# EAGLE schematic BeagleBone_Blue (EAGLE 7.3.0), part 2 of 2
## Sheet 10 of 10
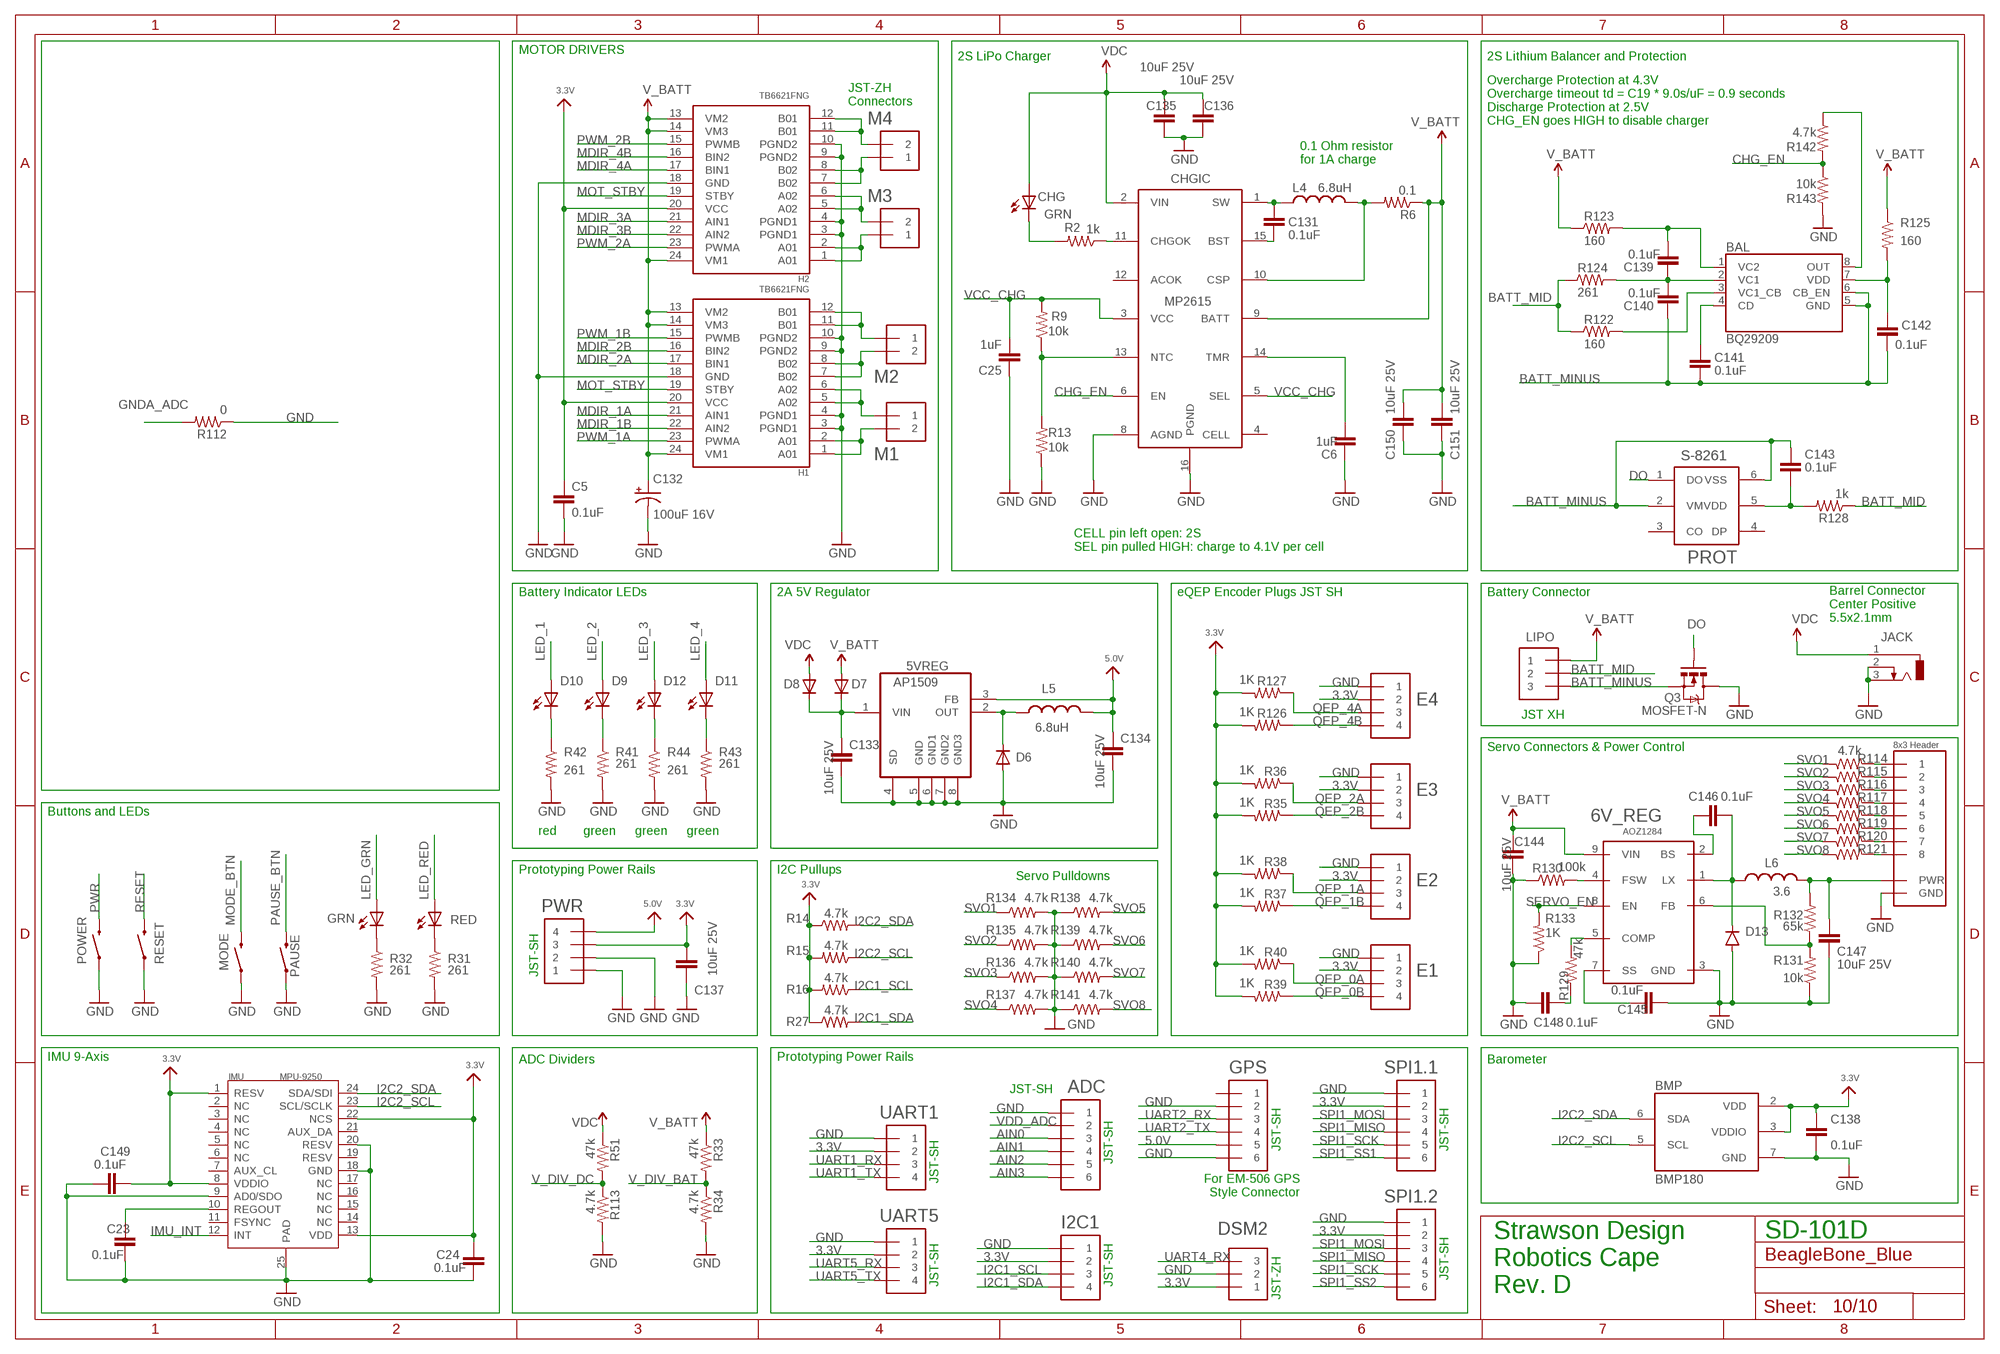
[diagram p15: schematic, sheet 10]

### Parts
5VREG  AP1509SOIC-8-TIGHT  [SO08-TIGHT]
6V_REG  AOZ1284  [SO08-EXPOSED]
ADC  JST_SH_6  [JST_SH_6]
BAL  BQ29209  [8-SON_3X3MM]
BMP  BMP180  [BMP180]
C5  0.1uF  CAP0402-CAP  [0402-CAP]
C6  1uF  CAP0402-CAP  [0402-CAP]
C23  0.1uF  CAP0402-CAP  [0402-CAP]
C24  0.1uF  CAP0402-CAP  [0402-CAP]
C25  1uF  CAP0402-CAP  [0402-CAP]
C131  0.1uF  CAP0402-CAP  [0402-CAP]
C132  100uF 16V  CPOL-USD  [PANASONIC_D]
C133  10uF 25V  CAP0805  [0805]
C134  10uF 25V  CAP0805  [0805]
C135  10uF 25V  CAP0805  [0805]
C136  10uF 25V  CAP0805  [0805]
C137  10uF 25V  CAP0805  [0805]
C138  0.1uF  CAP0402-CAP  [0402-CAP]
C139  0.1uF  CAP0402-CAP  [0402-CAP]
C140  0.1uF  CAP0402-CAP  [0402-CAP]
C141  0.1uF  CAP0402-CAP  [0402-CAP]
C142  0.1uF  CAP0402-CAP  [0402-CAP]
C143  0.1uF  CAP0402-CAP  [0402-CAP]
C144  10uF 25V  CAP0805  [0805]
C145  0.1uF  CAP0402-CAP  [0402-CAP]
C146  0.1uF  CAP0402-CAP  [0402-CAP]
C147  10uF 25V  CAP0805  [0805]
C148  0.1uF  CAP0402-CAP  [0402-CAP]
C149  0.1uF  CAP0402-CAP  [0402-CAP]
C150  10uF 25V  CAP0805  [0805]
C151  10uF 25V  CAP0805  [0805]
CHG  GRN  LED0603  [LED-0603]
CHGIC  MP2615  [MP2615]
D6  DIODESOD-123  [SOD-123]
D7  DIODESOD-123  [SOD-123]
D8  DIODESOD-123  [SOD-123]
D9  GREEN  LED0603  [LED-0603]
D10  RED  LED0603  [LED-0603]
D11  GREEN  LED0603  [LED-0603]
D12  GREEN  LED0603  [LED-0603]
D13  DIODEDO214AA  [DO-214AA]
DSM2  JST_ZH_3  [JST_ZH_3]
E1  JST_SH_4  [JST_SH_4_SMD]
E2  JST_SH_4  [JST_SH_4_SMD]
E3  JST_SH_4  [JST_SH_4_SMD]
E4  JST_SH_4  [JST_SH_4_SMD]
GPS  JST_SH_6  [JST_SH_6]
GRN  GRN  LED0603  [LED-0603]
H1  TB6621FNG  [SSOP24]
H2  TB6621FNG  [SSOP24]
I2C1  JST_SH_4  [JST_SH_4_SMD]
IMU  MPU-9250  [QFN24G-0.4-3X3MM]
JACK  5.5x2.1mm  DCJ0303  [DCJ0303]
L4  6.8uH  INDUCTORBOURNS_SRN6045  [SRN6045]
L5  6.8uH  INDUCTORBOURNS_SRN6045  [SRN6045]
L6  3.6  INDUCTOR  [8X8MM_INDUCTOR]
LIPO  JST_XH_3-PIN  [JST_XH_3-PIN]
M1  JST_ZH_2  [JST_ZH_2]
M2  JST_ZH_2  [JST_ZH_2]
M3  JST_ZH_2  [JST_ZH_2]
M4  JST_ZH_2  [JST_ZH_2]
MODE  SWITCH-MOMENTARY-2-SMD-1101NE  [TACTILE-SWITCH-1101NE]
PAUSE  SWITCH-MOMENTARY-2-SMD-1101NE  [TACTILE-SWITCH-1101NE]
POWER  SWITCH-MOMENTARY-2-SMD-1101NE  [TACTILE-SWITCH-1101NE]
PROT  S-8261  [SOT-236]
PWR  JST_SH_4  [JST_SH_4_SMD]
Q3  MOSFET-N  MOSFET-NCHANNEL  [SO08-TIGHT]
R2  1k  RESISTOR0402-RES  [0402-RES]
R6  0.1  RESISTOR0603  [0603-RES]
R9  10k  RESISTOR0402-RES  [0402-RES]
R13  10k  RESISTOR0402-RES  [0402-RES]
R14  4.7k  RESISTOR0402-RES  [0402-RES]
R15  4.7k  RESISTOR0402-RES  [0402-RES]
R16  4.7k  RESISTOR0402-RES  [0402-RES]
R27  4.7k  RESISTOR0402-RES  [0402-RES]
R31  261  RESISTOR0402-RES  [0402-RES]
R32  261  RESISTOR0402-RES  [0402-RES]
R33  47k  RESISTOR0402-RES  [0402-RES]
R34  4.7k  RESISTOR0402-RES  [0402-RES]
R35  1K  RESISTOR0402-RES  [0402-RES]
R36  1K  RESISTOR0402-RES  [0402-RES]
R37  1K  RESISTOR0402-RES  [0402-RES]
R38  1K  RESISTOR0402-RES  [0402-RES]
R39  1K  RESISTOR0402-RES  [0402-RES]
R40  1K  RESISTOR0402-RES  [0402-RES]
R41  261  RESISTOR0402-RES  [0402-RES]
R42  261  RESISTOR0402-RES  [0402-RES]
R43  261  RESISTOR0402-RES  [0402-RES]
R44  261  RESISTOR0402-RES  [0402-RES]
R51  47k  RESISTOR0402-RES  [0402-RES]
R112  0  RESISTOR0603  [0603-RES]
R113  4.7k  RESISTOR0402-RES  [0402-RES]
R114  4.7k  RESISTOR0402-RES  [0402-RES]
R115  4.7k  RESISTOR0402-RES  [0402-RES]
R116  4.7k  RESISTOR0402-RES  [0402-RES]
R117  4.7k  RESISTOR0402-RES  [0402-RES]
R118  4.7k  RESISTOR0402-RES  [0402-RES]
R119  4.7k  RESISTOR0402-RES  [0402-RES]
R120  4.7k  RESISTOR0402-RES  [0402-RES]
R121  4.7k  RESISTOR0402-RES  [0402-RES]
R122  160  RESISTOR0402-RES  [0402-RES]
R123  160  RESISTOR0402-RES  [0402-RES]
R124  261  RESISTOR0402-RES  [0402-RES]
R125  160  RESISTOR0402-RES  [0402-RES]
R126  1K  RESISTOR0402-RES  [0402-RES]
R127  1K  RESISTOR0402-RES  [0402-RES]
R128  1k  RESISTOR0402-RES  [0402-RES]
R129  47k  RESISTOR0402-RES  [0402-RES]
R130  100k  RESISTOR0402-RES  [0402-RES]
R131  10k  RESISTOR0402-RES  [0402-RES]
R132  65k  RESISTOR0402-RES  [0402-RES]
R133  1K  RESISTOR0402-RES  [0402-RES]
R134  4.7k  RESISTOR0402-RES  [0402-RES]
R135  4.7k  RESISTOR0402-RES  [0402-RES]
R136  4.7k  RESISTOR0402-RES  [0402-RES]
R137  4.7k  RESISTOR0402-RES  [0402-RES]
R138  4.7k  RESISTOR0402-RES  [0402-RES]
R139  4.7k  RESISTOR0402-RES  [0402-RES]
R140  4.7k  RESISTOR0402-RES  [0402-RES]
R141  4.7k  RESISTOR0402-RES  [0402-RES]
R142  4.7k  RESISTOR0402-RES  [0402-RES]
R143  10k  RESISTOR0402-RES  [0402-RES]
RED  RED  LED0603  [LED-0603]
RESET  SWITCH-MOMENTARY-2-SMD-1101NE  [TACTILE-SWITCH-1101NE]
SPI1.1  JST_SH_6  [JST_SH_6]
SPI1.2  JST_SH_6  [JST_SH_6]
U$7  SERVO_HEADERS_8X  [3X8_0.1"_HEADER]
UART1  JST_SH_4  [JST_SH_4_SMD]
UART5  JST_SH_4  [JST_SH_4_SMD]

### Nets
3.3V: BMP.2(VDD) BMP.3(VDDIO) C5.2 C24.1 C137.1 C138.1 C149.2 DSM2.P$1 E1.2 E2.2 E3.2 E4.2 H1.20(VCC) H2.20(VCC) I2C1.2 IMU.1(RESV) IMU.8(VDDIO) IMU.13(VDD) IMU.22(NCS) PWR.3 R14.1 R15.2 R16.2 R27.1 R35.2 R36.2 R37.2 R38.2 R39.2 R40.2 R126.2 R127.2 SPI1.1.2 SPI1.2.2 UART1.2 UART5.2
5.0V: 5VREG.3(FB) C134.1 GPS.5 L5.2 PWR.4
AIN0: ADC.3 ; also sheet 4
AIN1: ADC.4 ; also sheet 4
AIN2: ADC.5 ; also sheet 4
AIN3: ADC.6 ; also sheet 4
BATT_MID: LIPO.P$2 R122.1 R124.1 R128.1
BATT_MINUS: BAL.5(GND) BAL.6(CB_EN) C140.1 C141.2 C142.2 C143.1 LIPO.P$3 PROT.2(VM) PROT.6(VSS) Q3.1(S) Q3.2(S) Q3.3(S)
CHG_EN: CHGIC.6(EN) R142.2 R143.1
CO: BAL.8(OUT) R142.1
DO: PROT.1(DO) Q3.4(G)
GND: 5VREG.4(SD) 5VREG.5(GND) 5VREG.6(GND1) 5VREG.7(GND2) 5VREG.8(GND3) 6V_REG.3(GND) ADC.1 BMP.7(GND) C5.1 C6.1 C23.2 C24.2 C25.1 C132.- C133.2 C134.2 C135.2 C136.2 C137.2 C138.2 C144.1 C145.1 C147.1 C148.1 C149.1 C150.2 C151.2 CHGIC.8(AGND) CHGIC.16(PGND) D6.A D13.A DSM2.P$2 E1.1 E2.1 E3.1 E4.1 GPS.2 GPS.6 H1.3(PGND1) H1.4(PGND1) H1.9(PGND2) H1.10(PGND2) H1.18(GND) H2.3(PGND1) H2.4(PGND1) H2.9(PGND2) H2.10(PGND2) H2.18(GND) I2C1.1 IMU.9(AD0/SDO) IMU.18(GND) IMU.20(RESV) IMU.25(PAD) JACK.2 JACK.3 MODE.P$1 PAUSE.P$1 POWER.P$1 PWR.1 PWR.2 Q3.5(D) Q3.6(D) Q3.7(D) Q3.8(D) R13.1 R31.2 R32.2 R34.2 R41.2 R42.2 R43.2 R44.2 R112.1 R113.2 R130.1 R131.1 R133.1 R134.2 R135.2 R136.2 R137.2 R138.1 R139.1 R140.1 R141.1 R143.2 RESET.P$1 SPI1.1.1 SPI1.2.1 U$7.P$13(GND) U$7.P$14(GND) U$7.P$15(GND) U$7.P$16(GND) U$7.P$17(GND) U$7.P$18(GND) U$7.P$23(GND) U$7.P$24(GND) UART1.1 UART5.1 ; also sheet 2,3,4,5,6,7,8,9
GNDA_ADC: R112.2
I2C1_SCL: I2C1.3 R16.1 ; also sheet 4
I2C1_SDA: I2C1.4 R27.2 ; also sheet 4
I2C2_SCL: BMP.5(SCL) IMU.23(SCL/SCLK) R15.1 ; also sheet 4
I2C2_SDA: BMP.6(SDA) IMU.24(SDA/SDI) R14.2 ; also sheet 4
IMU_INT: IMU.12(INT) ; also sheet 3,4
L3: D12.C R44.1
L4: D11.C R43.1
LED_1: D10.A ; also sheet 3
LED_2: D9.A ; also sheet 3
LED_3: D12.A ; also sheet 3
LED_4: D11.A ; also sheet 3
LED_GRN: GRN.A ; also sheet 3
LED_RED: RED.A ; also sheet 3
MDIR_1A: H1.21(AIN1) ; also sheet 3
MDIR_1B: H1.22(AIN2) ; also sheet 3
MDIR_2A: H1.17(BIN1) ; also sheet 3
MDIR_2B: H1.16(BIN2) ; also sheet 4,6
MDIR_3A: H2.21(AIN1) ; also sheet 4,6
MDIR_3B: H2.22(AIN2) ; also sheet 4,6
MDIR_4A: H2.17(BIN1) ; also sheet 4,6
MDIR_4B: H2.16(BIN2) ; also sheet 4,6
MODE_BTN: MODE.P$2 ; also sheet 3
MOT1A: H1.1(A01) H1.2(A01) M1.P$2
MOT1B: H1.5(A02) H1.6(A02) M1.P$1
MOT2A: H1.11(B01) H1.12(B01) M2.P$1
MOT2B: H1.7(B02) H1.8(B02) M2.P$2
MOT3A: H2.1(A01) H2.2(A01) M3.P$1
MOT3B: H2.5(A02) H2.6(A02) M3.P$2
MOT4A: H2.11(B01) H2.12(B01) M4.P$2
MOT4B: H2.7(B02) H2.8(B02) M4.P$1
MOT_STBY: H1.19(STBY) H2.19(STBY) ; also sheet 3
N$4: CHG.C R2.2
N$5: GRN.C R32.1
N$6: R31.1 RED.C
N$7: R114.2 U$7.P$1
N$10: BAL.2(VC1) C139.1 C140.2 R124.2
N$11: BAL.1(VC2) C139.2 R123.2
N$12: C143.2 PROT.5(VDD) R128.2
N$13: 6V_REG.7(SS) C145.2
N$14: C23.1 IMU.10(REGOUT)
N$15: C131.1 CHGIC.15(BST)
N$16: 5VREG.2(OUT) D6.C L5.1
N$18: CHGIC.11(CHGOK) R2.1
N$20: CHGIC.13(NTC) R9.1 R13.2
N$24: BAL.4(CD) C141.1
N$25: R115.2 U$7.P$2
N$29: BAL.7(VDD) C142.1 R125.2
N$30: R116.2 U$7.P$3
N$38: R117.2 U$7.P$4
N$48: D9.C R41.1
N$49: D10.C R42.1
N$50: BAL.3(VC1_CB) R122.2
N$51: R118.2 U$7.P$5
N$52: R119.2 U$7.P$6
N$53: 6V_REG.2(BS) C146.1
N$54: R120.2 U$7.P$19
N$55: C131.2 CHGIC.1(SW) L4.1
N$56: R121.2 U$7.P$20
N$60: 6V_REG.1(LX) C146.2 D13.C L6.1
N$61: 6V_REG.4(FSW) R130.2
N$62: C147.2 L6.2 R132.2 U$7.P$7(PWR) U$7.P$8(PWR) U$7.P$9(PWR) U$7.P$10(PWR) U$7.P$11(PWR) U$7.P$12(PWR) U$7.P$21(PWR) U$7.P$22(PWR)
N$63: 6V_REG.5(COMP) R129.2
N$65: 6V_REG.6(FB) R131.2 R132.1
N$66: C148.2 R129.1
N$67: CHGIC.10(CSP) L4.2 R6.2
N$69: C6.2 CHGIC.14(TMR)
N$79: 5VREG.1(VIN) C133.1 D7.C D8.C
PAUSE_BTN: PAUSE.P$2 ; also sheet 3
PWM_1A: H1.23(PWMA) ; also sheet 3
PWM_1B: H1.15(PWMB) ; also sheet 3
PWM_2A: H2.23(PWMA) ; also sheet 3
PWM_2B: H2.15(PWMB) ; also sheet 3
PWR: POWER.P$2
QEP_0A: E1.3 R40.1 ; also sheet 4
QEP_0B: E1.4 R39.1 ; also sheet 4
QEP_1A: E2.3 R38.1 ; also sheet 4,6
QEP_1B: E2.4 R37.1 ; also sheet 4,6
QEP_2A: E3.3 R36.1 ; also sheet 3
QEP_2B: E3.4 R35.1 ; also sheet 3
QEP_4A: E4.3 R127.1 ; also sheet 3
QEP_4B: E4.4 R126.1 ; also sheet 3
RESET: RESET.P$2
SERVO_EN: 6V_REG.8(EN) R133.2 ; also sheet 4,6
SPI1_MISO: SPI1.1.4 SPI1.2.4 ; also sheet 4
SPI1_MOSI: SPI1.1.3 SPI1.2.3 ; also sheet 4
SPI1_SCK: SPI1.1.5 SPI1.2.5
SPI1_SS1: SPI1.1.6
SPI1_SS2: SPI1.2.6 ; also sheet 4
SVO1: R114.1 R134.1 ; also sheet 4
SVO2: R115.1 R135.1 ; also sheet 4
SVO3: R116.1 R136.1 ; also sheet 4
SVO4: R117.1 R137.1 ; also sheet 4
SVO5: R118.1 R138.2 ; also sheet 4,6
SVO6: R119.1 R139.2 ; also sheet 4,6
SVO7: R120.1 R140.2 ; also sheet 4,6
SVO8: R121.1 R141.2 ; also sheet 4,6
UART1_RX: UART1.3 ; also sheet 4
UART1_TX: UART1.4 ; also sheet 4
UART2_RX: GPS.3 ; also sheet 4
UART2_TX: GPS.4 ; also sheet 4
UART4_RX: DSM2.P$3 ; also sheet 3
UART5_RX: UART5.3 ; also sheet 4,6
UART5_TX: UART5.4 ; also sheet 4,6
V_BATT: 6V_REG.9(VIN) C132.+ C144.2 C150.1 C151.1 CHGIC.9(BATT) D7.A H1.13(VM2) H1.14(VM3) H1.24(VM1) H2.13(VM2) H2.14(VM3) H2.24(VM1) LIPO.P$1 R6.1 R33.1 R123.1 R125.1
V_DIV_BAT: R33.2 R34.1
V_DIV_DC: R51.2 R113.1
VCC: C135.1 C136.1 CHG.A CHGIC.2(VIN) D8.A JACK.1 R51.1 ; supply symbol labelled VDC ; also sheet 2,3,4,5,6,7,8,9
VCC_CHG: C25.2 CHGIC.3(VCC) CHGIC.5(SEL) R9.2
VDD_ADC: ADC.2
Unconnected: CHGIC.4(CELL) CHGIC.12(ACOK) GPS.1 IMU.2(NC) IMU.3(NC) IMU.4(NC) IMU.5(NC) IMU.6(NC) IMU.7(AUX_CL) IMU.11(FSYNC) IMU.14(NC) IMU.15(NC) IMU.16(NC) IMU.17(NC) IMU.19(RESV) IMU.21(AUX_DA) PROT.3(CO) PROT.4(DP)

### Notes on the sheet
- MOTOR DRIVERS
- 2S LiPo Charger | 2S Lithium Balancer and Protection
- JST-ZH
  Connectors
- Overcharge Protection at 4.3V
  Overcharge timeout td = C19 * 9.0s/uF = 0.9 seconds
  Discharge Protection at 2.5V
  CHG_EN goes HIGH to disable charger
- 0.1 Ohm resistor
  for 1A charge
- CELL pin left open: 2S
  SEL pin pulled HIGH: charge to 4.1V per cell
- Battery Indicator LEDs | 2A 5V Regulator | eQEP Encoder Plugs JST SH | Battery Connector
- Barrel Connector
  Center Positive
  5.5x2.1mm
- JST XH
- Servo Connectors & Power Control
- Buttons and LEDs
- red | green | green | green
- Prototyping Power Rails | I2C Pullups
- Servo Pulldowns
- JST-SH
- ADC Dividers | Barometer
- IMU 9-Axis | Prototyping Power Rails
- JST-SH
- JST-SH | JST-SH
- JST-SH
- JST-SH
- For EM-506 GPS
  Style Connector
- SD-101D
- JST-SH
- JST-SH | JST-SH
- Strawson Design
  Robotics Cape
  Rev. D
- JST-ZH

## Library data of the parts
5VREG = Strawson_Eagle_Lib:AP1509: 150KHz, 2A PWM BUCK DC/DC CONVERTER
6V_REG = Strawson_Eagle_Lib:AOZ1284
ADC GPS SPI1.1 SPI1.2 = Strawson_Eagle_Lib:JST_SH_6
BAL = Strawson_Eagle_Lib:BQ29209: BQ29209 2-CELL Balance and Overvoltage Protection
BMP = SparkFun-Sensors:BMP180: BOSCH BMP180 DIGITAL BAROMETRIC PRESSURE SENSOR Web page: http://www.bosch-sensortec.com/en/homepage/products_3/environmental_sensors_1/bmp180_1/bmp180 Datasheet: http://ae-bst.resource.bosch.com/media/products/dokumente/bmp180/BST-BMP180-DS000-09.pdf The BMP180 is the function compatible successor of the BMP085, a new generation of high precision digital pressure sensors for consumer applications. The ultra-low power, low voltage electronics of the BMP180 is optimized for use in mobile phones, PDAs, GPS navigation devices and outdoor equipment. With a low altitude noise of merely 0.25m at fast conversion time, the BMP180 offers superior performance. The I2C interface allows for easy system integration with a microcontroller. The BMP180 is based on piezo-resistive technology for EMC robustness, high accuracy and linearity as well as long term stability. Key features: - Temperature measurement included - I2C interface - Fully calibrated - Pb-free, halogen-free and RoHS compliant, - MSL 1 Basic specs: Pressure range: 300 to 1100hPa (+9000m to -500m relating to sea level) Supply voltage: 1.8 to 3.6V (VDD), 1.62V to 3.6V (VDDIO) Package: LGA package with metal lid Small footprint: 3.6mm x 3.8mm Super-flat: 0.93mm height Low power: 5μA at 1 sample / sec. in standard mode Low noise: 0.06hPa (0.5m) in ultra low power mode, 0.02hPa (0.17m) advanced resolution mode Typical applications: - Enhancement of GPS navigation (dead-reckoning, slope detection, etc.) - In- and out-door navigation - Leisure and sports - Weather forecast - Vertical velocity indication (rise/sink speed)
C1-C4 C7-C22 C24A C25A C26-C30 C158 C159 = eagle-ltspice:C: CAPACITOR, European symbol; SPICEMODEL: NONE; SPICEPREFIX: C
C5 C6 C23-C25 C131 C138-C143 C145 C146 C148 C149 = Strawson_Eagle_Lib:CAP: Capacitor Standard 0603 ceramic capacitor, and 0.1" leaded capacitor.
C31-C33 C35 C36 C155 = resistor:C-EU: CAPACITOR, European symbol
C34 = AVE107M06D16T-F:AVE107M06D16T-F
C37-C130 C152-C154 = rcl:C-EU: CAPACITOR, European symbol
C132 = adafruit:CPOL-US: POLARIZED CAPACITOR, American symbol
C133-C137 C144 C147 C150 C151 = SparkFun-Capacitors:CAP: Capacitor Standard 0603 ceramic capacitor, and 0.1" leaded capacitor.
CHG D9-D12 GRN RED = SparkFun-LED:LED: LEDs Standard schematic elements and footprints for 5mm, 3mm, 1206, and 0603 sized LEDs. 5mm - Spark Fun Electronics SKU : COM-00529 (and others)
CHGIC = Strawson_Eagle_Lib:MP2615
D1-D5 = led:LED: LED OSRAM: - CHIPLED LG R971, LG N971, LY N971, LG Q971, LY Q971, LO R971, LY R971 LH N974, LH R974 LS Q976, LO Q976, LY Q976 LO Q996 - Hyper CHIPLED LW Q18S LB Q993, LB Q99A, LB R99A - SideLED LS A670, LO A670, LY A670, LG A670, LP A670 LB A673, LV A673, LT A673, LW A673 LH A674 LY A675 LS A676, LA A676, LO A676, LY A676, LW A676 LS A679, LY A679, LG A679 - Hyper Micro SIDELED® LS Y876, LA Y876, LO Y876, LY Y876 LT Y87S - SmartLED LW L88C, LW L88S LB L89C, LB L89S, LG L890 LS L89K, LO L89K, LY L89K LS L896, LA L896, LO L896, LY L896 - TOPLED LS T670, LO T670, LY T670, LG T670, LP T670 LSG T670, LSP T670, LSY T670, LOP T670, LYG T670 LG T671, LOG T671, LSG T671 LB T673, LV T673, LT T673, LW T673 LH T674 LS T676, LA T676, LO T676, LY T676, LB T676, LH T676, LSB T676, LW T676 LB T67C, LV T67C, LT T67C, LS T67K, LO T67K, LY T67K, LW E67C LS E67B, LA E67B, LO E67B, LY E67B, LB E67C, LV E67C, LT E67C LW T67C LS T679, LY T679, LG T679 LS T770, LO T770, LY T770, LG T770, LP T770 LB T773, LV T773, LT T773, LW T773 LH T774 LS E675, LA E675, LY E675, LS T675 LS T776, LA T776, LO T776, LY T776, LB T776 LHGB T686 LT T68C, LB T68C - Hyper Mini TOPLED® LB M676 - Mini TOPLED Santana® LG M470 LS M47K, LO M47K, LY M47K Source: http://www.osram.convergy.de LUXEON: - LUMILED® LXK2-PW12-R00, LXK2-PW12-S00, LXK2-PW14-U00, LXK2-PW14-V00 LXK2-PM12-R00, LXK2-PM12-S00, LXK2-PM14-U00 LXK2-PE12-Q00, LXK2-PE12-R00, LXK2-PE12-S00, LXK2-PE14-T00, LXK2-PE14-U00 LXK2-PB12-K00, LXK2-PB12-L00, LXK2-PB12-M00, LXK2-PB14-N00, LXK2-PB14-P00, LXK2-PB14-Q00 LXK2-PR12-L00, LXK2-PR12-M00, LXK2-PR14-Q00, LXK2-PR14-R00 LXK2-PD12-Q00, LXK2-PD12-R00, LXK2-PD12-S00 LXK2-PH12-R00, LXK2-PH12-S00 LXK2-PL12-P00, LXK2-PL12-Q00, LXK2-PL12-R00 Source: www.luxeon.com KINGBRIGHT: KA-3528ASYC Source: www.kingbright.com
D6-D8 = adafruit:DIODE: Diode
D13 = Strawson_Eagle_Lib:DIODE: Diode
DSM2 = Strawson_Eagle_Lib:JST_ZH_3
E1-E4 I2C1 PWR UART1 UART5 = Strawson_Eagle_Lib:JST_SH_4
FB1-FB3 FB7 FB8 = Bourns_By_element14_Batch_1:PM0805-R10K-RC: CHIP INDUCTOR, 100NH, 400mA, 10%, 1.2GHZ; MPN: PM0805-R10K-RC; OC_FARNELL: -; OC_NEWARK: 63K3004; SUPPLIER: BOURNS; TOLERANCE: ±10 %; VALUE: 100 nH
H1 H2 = SparkFun:TB6621FNG: Toshiba 1A motor driver
IMU = Strawson_Eagle_Lib:MPU-9250: 314990005; MPN: MPU-9250
J1 = 68000-406HLF:68000-406HLF
JACK = con-jack:DCJ0303: DC POWER JACK Source: DCJ0303.pdf; OC_FARNELL: unknown; OC_NEWARK: unknown
JP1 = Strawson_Eagle_Lib:USB-AB: This is a USB AB connector that is compatible with USB OTG. i.e. this connector can serve as a host or device
L1-L3 = LQM2HPN2RMG0L:LQM2HPN2RMG0L
L4 L5 = SparkFun-Passives:INDUCTOR: Inductors; PROD_ID: NDUC-11627; VALUE: 33uH
L6 = Strawson_Eagle_Lib:INDUCTOR: Inductors; VALUE: 3.3uH
LIPO = Strawson_Eagle_Lib:JST_XH_3-PIN
M1-M4 = Strawson_Eagle_Lib:JST_ZH_2
MODE PAUSE POWER RESET = SparkFun-Electromechanical:SWITCH-MOMENTARY-2: Various NO switches- pushbuttons, reed, etc
P2 = CTIJTAG:CTIJTAG
P3 = 87520-0010BLF:87520-0010BLF
PROT = Strawson_Eagle_Lib:S-8261
Q3 = Strawson_Eagle_Lib:MOSFET-NCHANNEL: Common NMOSFET Parts MFG P/N Store ID Prod ID FDD8780 TRANS-09984 SI7820DN TRANS-11055 FDS6630A IC-08089 2N7002PW TRANS-11151 FQP30N06L COM-10213 TRANS-10060 BSS123LT1G TRANS-08345 BSS138 TRANS-00830 BS170 2N7000
R1 R3-R5 R6A R7 R8 R10-R12 R14A R17-R26 R27A R28-R30 R45-R50 R52 R53 R55-R111 R159-R165 R167 = rcl:R-US_: RESISTOR, American symbol
R2 R9 R13-R16 R27 R31-R44 R51 R113-R143 = Strawson_Eagle_Lib:RESISTOR: Resistor Basic schematic elements and footprints for 0603, 1206, and PTH resistors.
R6 R112 = SparkFun-Resistors:RESISTOR: Resistor Basic schematic elements and footprints for 0603, 1206, and PTH resistors.
R54 R150-R157 = resistor:R-US_: RESISTOR, American symbol
S1-S3 = KMR231GLFS:KMR231GLFS
TP2-TP4 = TESTPOINT:TESTPOINT
U3 = SN74LVC1G06:SN74LVC1G06_DCK_5; DATASHEETURL: http://www.ti.com/lit/gpn/SN74LVC1G06; DESCRIPTION: Single Inverter Buffer/Driver With Open-Drain Output; FAMILY_NAME: LL INVERTING BUFFER AND DRIVER; GENERIC_PART_NUMBER: SN74LVC1G06; INDUSTRY_STD_PKG_TYPE: SC70; MANUFACTURER: Texas Instruments; MANUFACTURER_PART_NUMBER: sn74lvc1g06_dck_5; PACKAGE_DESIGNATOR: DCK; PIN_COUNT: 5; VENDOR: Texas Instruments
U4 = TL5209:TL5209
U5 = AM3358BZCZ:AM3358_BZCZ_324
U6 = SN74LVC1G74:SN74LVC1G74_DCT_8; DATASHEETURL: http://www.ti.com/lit/gpn/SN74LVC1G74; DESCRIPTION: Single Positive-Edge-Triggered D-Type Flip-Flop With Clear and Preset; FAMILY_NAME: LL FLIP-FLOP; GENERIC_PART_NUMBER: SN74LVC1G74; INDUSTRY_STD_PKG_TYPE: SM8; MANUFACTURER: Texas Instruments; MANUFACTURER_PART_NUMBER: sn74lvc1g74_dct_8; PACKAGE_DESIGNATOR: DCT; PIN_COUNT: 8; VENDOR: Texas Instruments
U7 = Microchip-24LCxxx:24LC_: IC, I2C Serial EEPROM,SOT-23-5; MPN: 24LC32AT-I/OT; OC_FARNELL: 1700993; OC_NEWARK: 08P0113; PACKAGE: SOT-23-5; SUPPLIER: MICROCHIP
U8 = TPS2051B:TPS2051B_D_8; DATASHEETURL: http://www.ti.com/lit/gpn/TPS2051B; DESCRIPTION: Single, Current-Limited, Power-Distribution Switch; FAMILY_NAME: USB POWER SWITCH; GENERIC_PART_NUMBER: TPS2051B; INDUSTRY_STD_PKG_TYPE: SOIC; MANUFACTURER: Texas Instruments; MANUFACTURER_PART_NUMBER: tps2051b_d_8; PACKAGE_DESIGNATOR: D; PIN_COUNT: 8; VENDOR: Texas Instruments
U9 U10 = TPD4S012:TPD4S012_DRY_6; DATASHEETURL: http://www.ti.com/lit/gpn/TPD4S012; DESCRIPTION: 4-Channel USB ESD Solution with Power Clamp; FAMILY_NAME: ESD Solution; GENERIC_PART_NUMBER: TPD4S012; INDUSTRY_STD_PKG_TYPE: SON; MANUFACTURER: Texas Instruments; MANUFACTURER_PART_NUMBER: tpd4s012_dry_6; PACKAGE_DESIGNATOR: DRY; PIN_COUNT: 6; VENDOR: Texas Instruments
U12 = MT41K256M16HA:MT41K256M16HA
U13 = MTFC4GLDEA0M:MTFC4GLDEA
U15 = SN74LVC2G241:SN74LVC2G241_DCU_8; DATASHEETURL: http://www.ti.com/lit/gpn/SN74LVC2G241; DESCRIPTION: Dual Buffer/Driver With 3-State Outputs; FAMILY_NAME: LL BUFFER AND DRIVER WITH 3-STATE OUTPUT; GENERIC_PART_NUMBER: SN74LVC2G241; INDUSTRY_STD_PKG_TYPE: US8; MANUFACTURER: Texas Instruments; MANUFACTURER_PART_NUMBER: sn74lvc2g241_dcu_8; PACKAGE_DESIGNATOR: DCU; PIN_COUNT: 8; VENDOR: Texas Instruments
U16 = SN74LVC1G07:SN74LVC1G07_DCK_5; DATASHEETURL: http://www.ti.com/lit/gpn/SN74LVC1G07; DESCRIPTION: Single Buffer/Driver With Open-Drain Output; FAMILY_NAME: LL BUFFER AND DRIVER WITH OPEN-DRAIN OUTPUT; GENERIC_PART_NUMBER: SN74LVC1G07; INDUSTRY_STD_PKG_TYPE: SC70; MANUFACTURER: Texas Instruments; MANUFACTURER_PART_NUMBER: sn74lvc1g07_dck_5; PACKAGE_DESIGNATOR: DCK; PIN_COUNT: 5; VENDOR: Texas Instruments
U$3 = TPS65217C:TPS65217C
U$4 U$5 = DMC564040R:DMC564040R
U$7 = Strawson_Eagle_Lib:SERVO_HEADERS_8X
Y1 = CM200C-32.768KAZF-UT:CM200C-32.768KAZF-UT
Y2 = 445C33D24M00000:445C33D24M00000
Y4 = ASDMB-24.576MHZ-LC-T:ASDMB-24.576MHZ-LC-T